# Altium schematic sheet STM32-PROX_7.SchDoc
size 94 x 98 mm
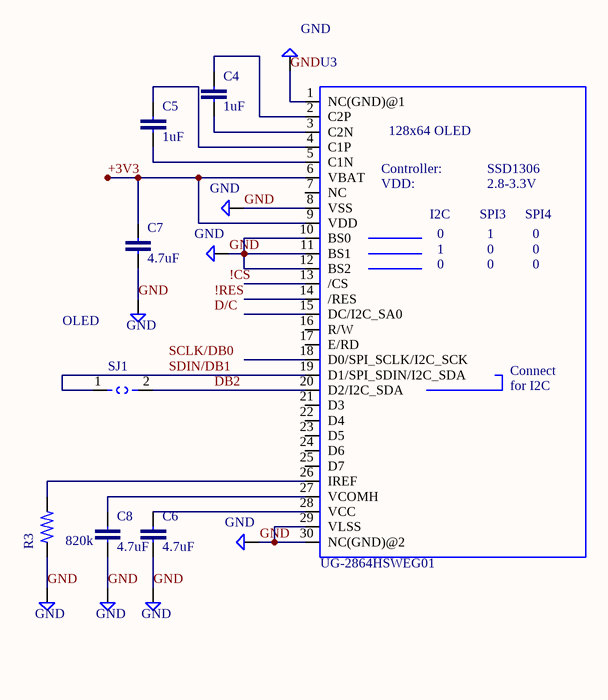
[diagram p0: STM32-PROX_7.SchDoc]

## Parts
C4  1uF  [0805]
C5  1uF  [0805]
C6  4.7uF  [0805]
C7  4.7uF  [0805]
C8  4.7uF  [0805]
GND3  GND
GND12  GND
GND13  GND
GND14  GND
GND15  GND
GND16  GND
GND17  GND
GND18  GND
R3  820k  [RLC_0603]
SJ1  (no value)  [SOLDERJUMPER_REFLOW]
U3  UG-2864HSWEG01  [MICROBUILDER_UG-2864HSWEG01_0.96IN_WRAPAROUND]

## Nets
+3V3: C7.1 U3.6(VBAT) U3.9(VDD)
DB2: SJ1.2 U3.20(D2/I2C_SDA)
GND: C6.2 C7.2 C8.2 GND3.0(GND) GND12.0(GND) GND13.0(GND) GND14.0(GND) GND15.0(GND) GND16.0(GND) GND17.0(GND) GND18.0(GND) R3.1 U3.1(NC(GND)@1) U3.8(VSS) U3.10(BS0) U3.11(BS1) U3.12(BS2) U3.29(VLSS) U3.30(NC(GND)@2)
SDIN/DB1: SJ1.1 U3.19(D1/SPI_SDIN/I2C_SDA)
NetC4_1: C4.1 U3.2(C2P)
NetC4_2: C4.2 U3.3(C2N)
NetC5_1: C5.1 U3.4(C1P)
NetC5_2: C5.2 U3.5(C1N)
NetC6_1: C6.1 U3.28(VCC)
NetC8_1: C8.1 U3.27(VCOMH)
NetR3_2: R3.2 U3.26(IREF)

Not connected (* = marked no-connect by the designer): U3 7(NC) 13(/CS) 14(/RES) 15(DC/I2C_SA0) 16(R/W) 17(E/RD) 18(D0/SPI_SCLK/I2C_SCK) 21(D3) 22(D4) 23(D5) 24(D6) 25(D7)

## Notes on the sheet
- OLED
- Labels drawn without touching a wire or pin: !CS, !RES, D/C, SCLK/DB0
- (in symbol MICROBUILDER_DISP_OLED_UG-2864HSWEG010.96") 128x64 OLED; Controller:; SSD1306; VDD:; 2.8-3.3V; I2C; SPI3; SPI4; 0; Connect; for I2C

## Library data of the parts
C4-C8 = CAP0805
R3 = RESISTORRLC_0603
SJ1 = SOLDERJUMPERREFLOW
U3 = MICROBUILDER_DISP_OLED_UG-2864HSWEG010.96"